# Altium schematic sheet CAN.SchDoc: Dahlia Carrier Board
size A3; Organization: Toradex AG; Address1: Ebenaustrasse 10; Address2: Horw; Address3: 6048; Address4: Switzerland; DocumentNumber: 13; Revision: V1.1; SheetNumber: 13; SheetTotal: 21; PageSetup: Record=PageOptions|CenterHorizontal=True|CenterVertical=True|PrintScale=0.71|XCorrection=1.00|YCorrection=1.00|PrintKind=1|BorderSize=5000000|LeftOffset=0|BottomOffset=0|Orientation=2|PaperLength=1000|PaperWidth=1000|Scale=100|PaperSource=15|PrintQuality=600|MediaType=1|DitherType=10|PaperKind=A4|PrintScaleMode=1
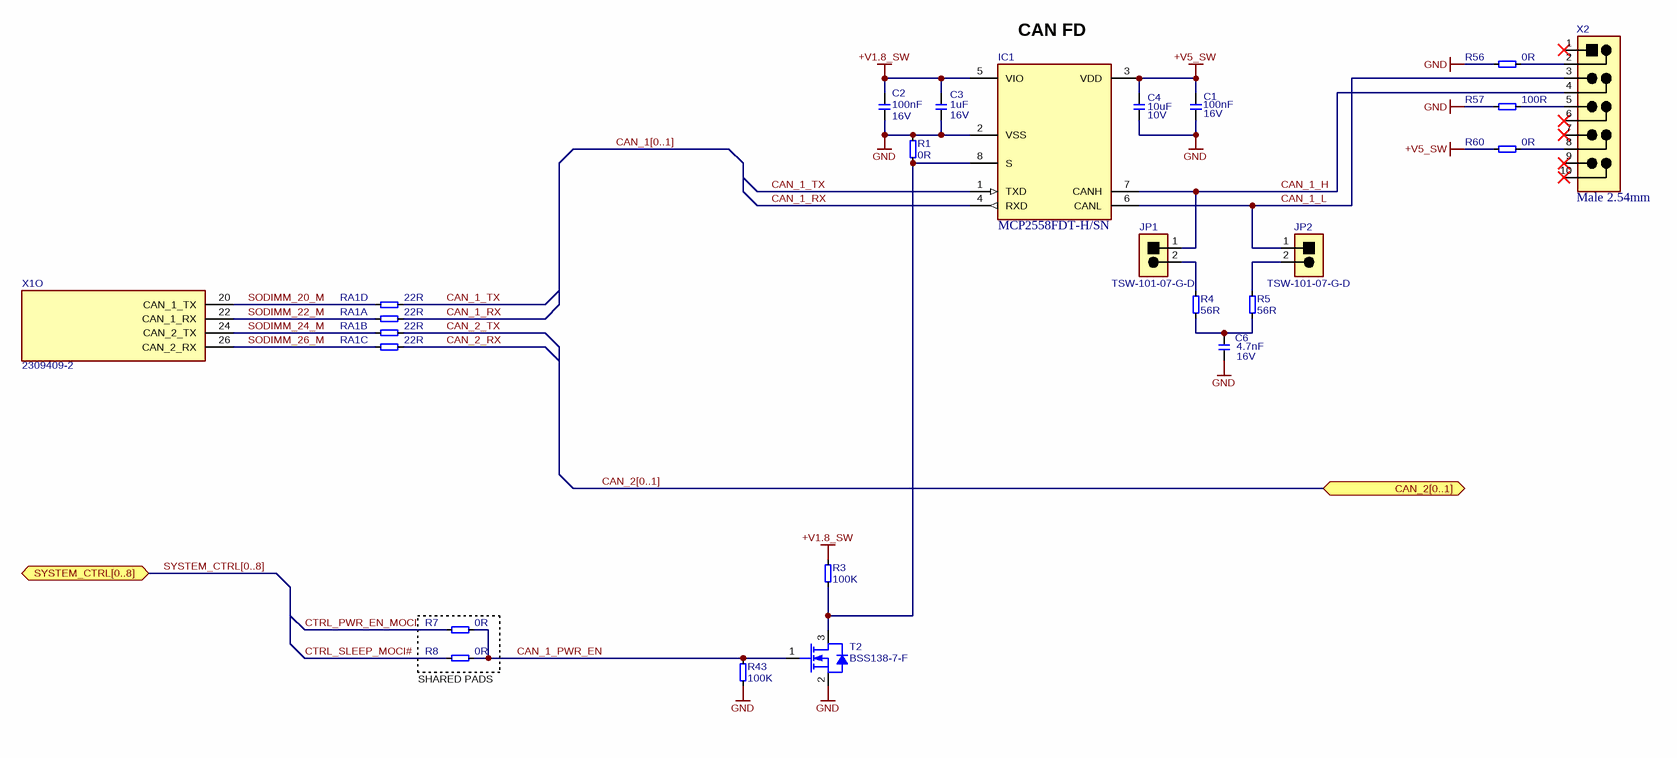
[diagram p0: CAN.SchDoc]

## Parts
C1  Rating: 16V  [CAPC1005X60N]  (hidden comment: 100nF)
C2  Rating: 16V  [CAPC1005X60N]  (hidden comment: 100nF)
C3  Rating: 16V  [CAPC1005X60N]  (hidden comment: 1uF)
C4  Rating: 10V  [T_CAPC0603X33N]  (hidden comment: 10uF)
C6  Rating: 16V  [T_CAPC0603X33N]  (hidden comment: 4.7nF)
IC1  MCP2558FDT-H/SN  [IC-SOIC-8]
JP1  TSW-101-07-G-D  [T_Samtec_TSW-101-07-G-D]
JP2  TSW-101-07-G-D  [T_Samtec_TSW-101-07-G-D]
R1  0R  [T_RESC0603X30N]
R3  100K  [RESC1005X40N]
R4  56R  [T_RESC0603X30N]
R5  56R  [T_RESC0603X30N]
R7  0R  [T_RESC0603X30N]
R8  0R  [T_RESC0603X30N]
R43  100K  [RESC1005X40N]
R56  0R  [T_RESC0603X30N]
R57  100R  [T_RESC0603X30N]
R60  0R  [T_RESC0603X30N]
RA1  22R  [T_Resistor_Array_X4]  (parts A,B,C,D of 4)
T2  BSS138-7-F  [SOT95P237X112-3N]
X1  2309409-2  [CON-TE-2309409-2-SOLDERABLE-STANDOFFS]  (part O of 23)
X2  Male 2.54mm  [CON-Header-2x5-Male-2.54mm]

## Ports
CAN_2[0..1] (bidir), SYSTEM_CTRL[0..8] (bidir)

## Nets
+V1.8_SW: C2.2 C3.2 IC1.5(VIO) R3.1
+V5_SW: C1.2 C4.2 IC1.3(VDD) R60.2
GND: C1.1 C2.1 C3.1 C4.1 C6.1 IC1.2(VSS) R1.2 R43.2 R56.2 R57.1 T2.2(S)
CAN_1_H: IC1.7(CANH) JP1.1 X2.4
CAN_1_L: IC1.6(CANL) JP2.1 X2.3
CAN_1_PWR_EN: R7.2 R8.2 R43.1 T2.1(G)
CAN_1_RX: IC1.4(RXD) RA1.5
CAN_1_TX: IC1.1(TXD) RA1.8
CAN_2_RX: RA1.7
CAN_2_TX: RA1.6
CTRL_PWR_EN_MOCI: R7.1
CTRL_SLEEP_MOCI#: R8.1
SODIMM_20_M: RA1.4 X1.20(CAN_1_TX)
SODIMM_22_M: RA1.1 X1.22(CAN_1_RX)
SODIMM_24_M: RA1.2 X1.24(CAN_2_TX)
SODIMM_26_M: RA1.3 X1.26(CAN_2_RX)
NetC6_2: C6.2 R4.1 R5.1
NetIC1_8: IC1.8(S) R1.1 R3.2 T2.3(D)
NetJP1_2: JP1.2 R4.2
NetJP2_2: JP2.2 R5.2
NetR56_1: R56.1 X2.2
NetR57_2: R57.2 X2.5
NetR60_1: R60.1 X2.8

Not connected (* = marked no-connect by the designer): X2 1* 6* 7* 9* 10*

## Buses and harness runs
bus CAN_1[0..1]
bus CAN_2[0..1] = port CAN_2[0..1]
bus SYSTEM_CTRL[0..8] = port SYSTEM_CTRL[0..8]

## Notes on the sheet
- (near IC1) CAN FD
- (near R8) SHARED PADS
- Title
- Size:
- Date:
- A3
- Number:
- Time:
- Revision:
- Sheet
- of
- File:

## Library data of the parts
C1 C2 = C-X7R-100nF-16V-10%-0402: Capacitor Ceramic X7R 100nF 16V 10% 0402; Tolerance: 10%; Type: X7R; Value: 100nF
C3 = C-X5R-1uF-16V-20%-0402: Capacitor Ceramic X5R 1uF 16V 20% 0402; Tolerance: 20%; Type: X5R; Value: 1uF
C4 = C-X5R-10uF-10V-20%-0603: Capacitor Ceramic X5R 10uF 10V 20% 0603; Tolerance: 20%; Type: X5R; Value: 10uF
C6 = C-X7R-4.7nF-16V-10%-0603: Capacitor Ceramic X7R 4.7nF 16V 10% 0603; Type: X7R; Tolerance: 10%; Value: 4.7nF
IC1 = IC-Microchip-MCP2558FDT-H/SN: CAN FD Transceiver with Silent Mode; Manufacturer Name: Microchip; Temperature Range: -40C to +150C; Package: SOIC-8; Manufacturer Part No.: MCP2558FDT-H/SN
JP1 JP2 = CON-Samtec-TSW-101-07-G-D: Header male, 1x2 Pins, 2.54 mm pitch; Manufacturer Name: Samtec; Pitch: 2.54 mm; No. of ways: 1x2; Manufacturer Part no.: TSW-101-07-G-D
R1 R7 R8 R56 R60 = R-0R-63mW-1%-0603: Resistor 0 ohm 63mW 1% 0603; Rating: 63mW; Tolerance: 1%; Value: 0R
R3 R43 = R-100K-63mW-5%-0402: Resistor 100 Kohm 63mW 5% 0402; Rating: 63mW; Tolerance: 5%; Value: 100K
R4 R5 = R-56R-125mW-1%-0603: Resistor 56 ohm 125mW 1% 0603; Rating: 125mW; Tolerance: 1%; Value: 56R
R57 = R-100R-63mW-5%-0603: Resistor 100 ohm 63mW 5% 0603; Rating: 63mW; Tolerance: 5%; Value: 100R
RA1 = RA-22R-63mW-5%-1206-div: Resistor Array 22 R 63mW 5% 1206; Tolerance: 5%; Power Dissipation: 63mW; Value: 22R
T2 = T-Diodes-BSS138-7-F: N-channel MOSFET, BSS138-7-F; Manufacturer Name: Diodes; Manufacturer Part No.: BSS138-7-F
X1 = CON-TE-2309409-2: DDR4 SODIMM Socket, 260 pins, 5.2mm(H), 0.5mm Pitch; Manufacturer Name: TE; Temperature Range: -40C to +125C; Package: DDR4-SODIMM-260; Manufacturer Part No.: 2309409-2
X2 = CON-Header-2x5-Male-2.54mm: Header Male, 2x5 Pins, 2.54mm pitch; Manufacturer Name: FCI; Manufacturer Part No.: 77313-101-10LF; No. of ways: 10